# EasyEDA Pro project Car.eprj, schematic Schematic1
Board Name: EverythingElse; Create Date: 2025-08-09; Page Name: P1; Project Name: Car; Schematic Name: Schematic1; Update Date: 2025-08-16; Company: EasyEDA.com; Page Size: A4; Version: V1.0
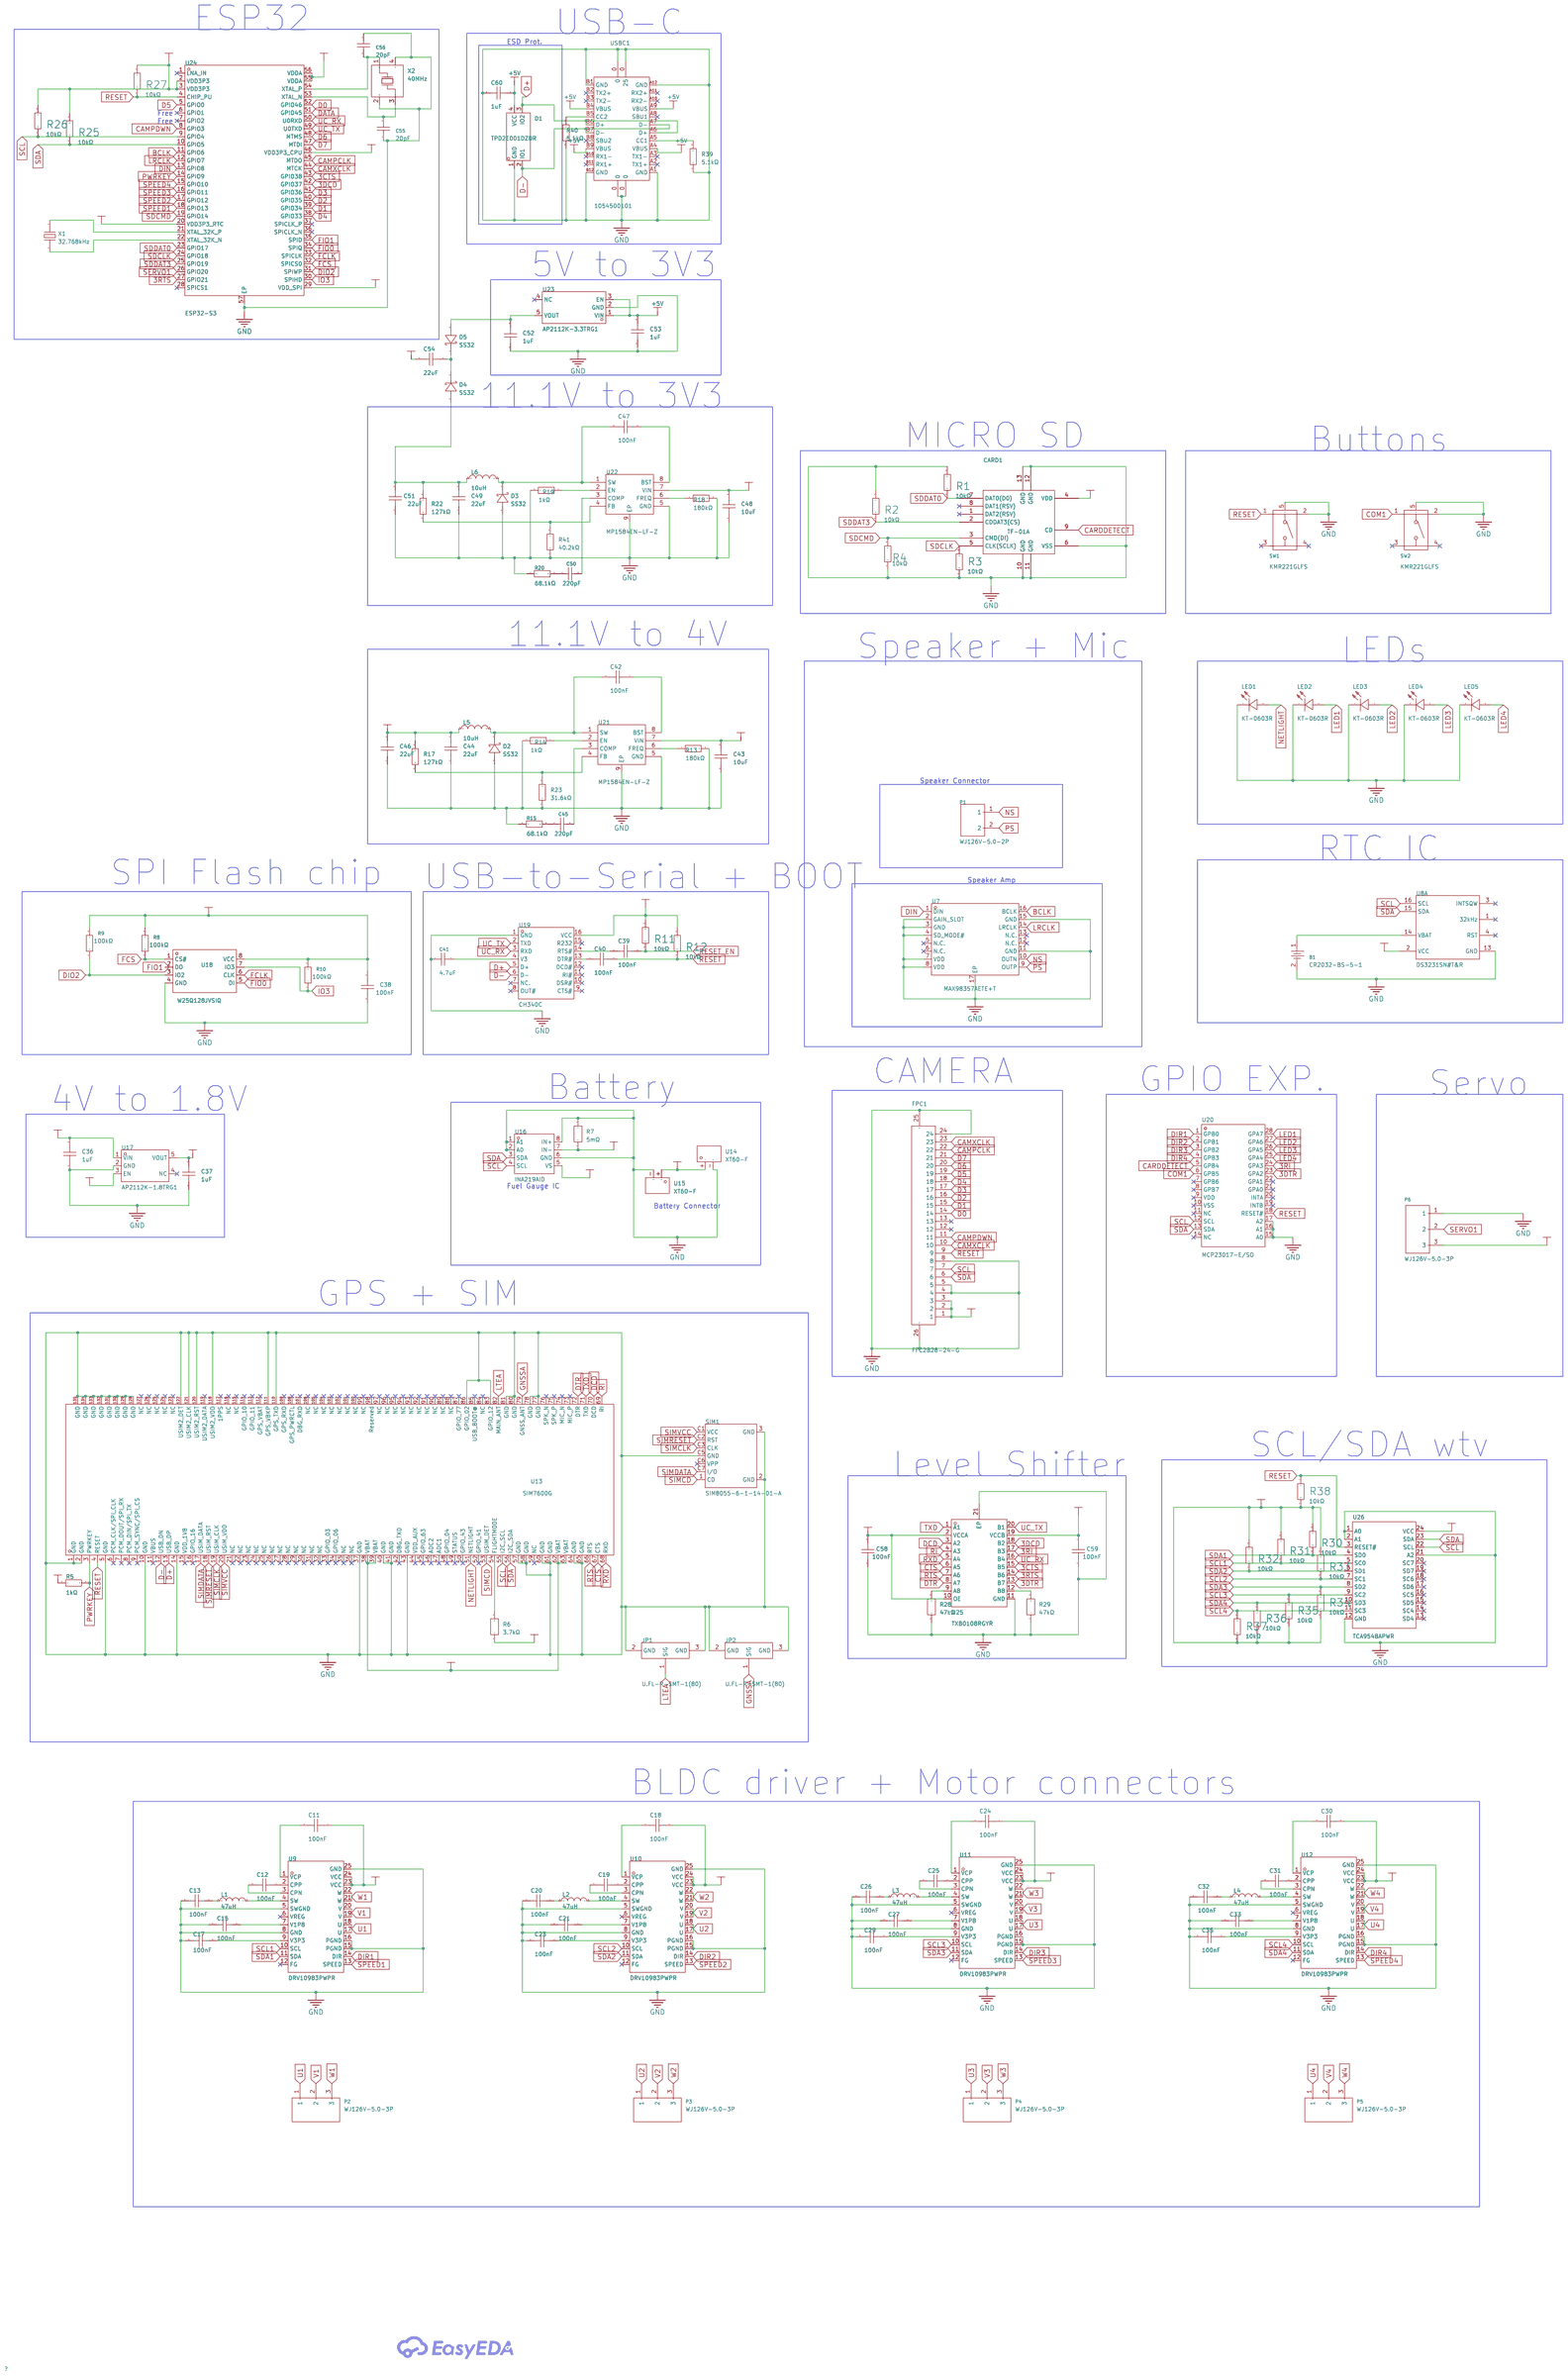
[diagram p0: schematic sheet]

## Parts
B1  CR2032-BS-5-1  [BAT-TH_CR2032-BS-5-1]
C11  100nF  [C0402]
C12  100nF  [C0402]
C13  100nF  [C0402]
C15  100nF  [C0402]
C17  100nF  [C0402]
C18  100nF  [C0402]
C19  100nF  [C0402]
C20  100nF  [C0402]
C21  100nF  [C0402]
C23  100nF  [C0402]
C24  100nF  [C0402]
C25  100nF  [C0402]
C26  100nF  [C0402]
C27  100nF  [C0402]
C29  100nF  [C0402]
C30  100nF  [C0402]
C31  100nF  [C0402]
C32  100nF  [C0402]
C33  100nF  [C0402]
C35  100nF  [C0402]
C36  1uF  [C0603]
C37  1uF  [C0603]
C38  100nF  [C0402]
C39  100nF  [C0402]
C40  100nF  [C0402]
C41  4.7uF  [C0402]
C42  100nF  [C0402]
C43  10uF  [C0805]
C44  22uF  [C0805]
C45  220pF  [C0603]
C46  22uF  [C0805]
C47  100nF  [C0402]
C48  10uF  [C0805]
C49  22uF  [C0805]
C50  220pF  [C0603]
C51  22uF  [C0805]
C52  1uF  [C0603]
C53  1uF  [C0603]
C54  22uF  [C0805]
C55  20pF  [C0402]
C56  20pF  [C0402]
C58  100nF  [C0402]
C59  100nF  [C0402]
C60  1uF  [C0603]
CARD1  TF-01A  [TF-SMD_TF-01A]
D1  TPD2E001DZDR  [SOT-143_L2.9-W1.3-P1.92-LS2.3-BR]
D2  SS32  [SMAF_L4.3-W2.5-LS5.0-RD]
D3  SS32  [SMAF_L4.3-W2.5-LS5.0-RD]
D4  SS32  [SMAF_L4.3-W2.5-LS5.0-RD]
D5  SS32  [SMAF_L4.3-W2.5-LS5.0-RD]
FPC1  FFC2B28-24-G  [FPC-SMD_24P-P0.50_XKB_X05A10L24G]
JP1  U.FL-R-SMT-1(80)  [RF-SMD_FRF05002-JSS103M]
JP2  U.FL-R-SMT-1(80)  [RF-SMD_FRF05002-JSS103M]
L1  47uH  [IND-SMD_L7.0-W6.6_FXL0630]
L2  47uH  [IND-SMD_L7.0-W6.6_FXL0630]
L3  47uH  [IND-SMD_L7.0-W6.6_FXL0630]
L4  47uH  [IND-SMD_L7.0-W6.6_FXL0630]
L5  10uH  [IND-SMD_L12.0-W12.0]
L6  10uH  [IND-SMD_L12.0-W12.0]
LED1  KT-0603R  [LED0603-RD]
LED2  KT-0603R  [LED0603-RD]
LED3  KT-0603R  [LED0603-RD]
LED4  KT-0603R  [LED0603-RD]
LED5  KT-0603R  [LED0603-RD]
P1  WJ126V-5.0-2P  [CONN-TH_WJ126V-5.0-2P]
P2  WJ126V-5.0-3P  [CONN-TH_3P-P5.00_WJ126V-5.0-3P]
P3  WJ126V-5.0-3P  [CONN-TH_3P-P5.00_WJ126V-5.0-3P]
P4  WJ126V-5.0-3P  [CONN-TH_3P-P5.00_WJ126V-5.0-3P]
P5  WJ126V-5.0-3P  [CONN-TH_3P-P5.00_WJ126V-5.0-3P]
P6  WJ126V-5.0-3P  [CONN-TH_3P-P5.00_WJ126V-5.0-3P]
R1  10kΩ  [R0603]
R2  10kΩ  [R0603]
R3  10kΩ  [R0603]
R4  10kΩ  [R0603]
R5  1kΩ  [R0603]
R6  3.7kΩ  [C0805]
R7  5mΩ  [R2818]
R8  100kΩ  [R0402]
R9  100kΩ  [R0402]
R10  100kΩ  [R0402]
R11  10kΩ  [R0603]
R12  10kΩ  [R0603]
R13  180kΩ  [R0603]
R14  1kΩ  [R0603]
R15  68.1kΩ  [R0603]
R17  127kΩ  [R0603]
R18  180kΩ  [R0603]
R19  1kΩ  [R0603]
R20  68.1kΩ  [R0603]
R22  127kΩ  [R0603]
R23  31.6kΩ  [R0402]
R25  10kΩ  [R0603]
R26  10kΩ  [R0603]
R27  10kΩ  [R0603]
R28  47kΩ  [R0603]
R29  47kΩ  [R0603]
R30  10kΩ  [R0603]
R31  10kΩ  [R0603]
R32  10kΩ  [R0603]
R33  10kΩ  [R0603]
R34  10kΩ  [R0603]
R35  10kΩ  [R0603]
R36  10kΩ  [R0603]
R37  10kΩ  [R0603]
R38  10kΩ  [R0603]
R39  5.1kΩ  [R0603]
R40  5.1kΩ  [R0603]
R41  40.2kΩ  [R0603]
SIM1  SIM8055-6-1-14-01-A  [SIM-SMD_SIM8055-6-1-14-01-A]
SW1  KMR221GLFS  [KEY-SMD_KMR2XXGXXX]
SW2  KMR221GLFS  [KEY-SMD_KMR2XXGXXX]
U7  MAX98357AETE+T  [TQFN-16_L3.0-W3.0-P0.50-BL-EP1.5]
U8  DS3231SN#T&R  [SOIC-16_L10.3-W7.5-P1.27-LS10.3-BL]  (section 1)
U9  DRV10983PWPR  [HTSSOP-24_L7.8-W4.4-P0.65-LS6.4-BL-EP-1]
U10  DRV10983PWPR  [HTSSOP-24_L7.8-W4.4-P0.65-LS6.4-BL-EP-1]
U11  DRV10983PWPR  [HTSSOP-24_L7.8-W4.4-P0.65-LS6.4-BL-EP-1]
U12  DRV10983PWPR  [HTSSOP-24_L7.8-W4.4-P0.65-LS6.4-BL-EP-1]
U13  SIM7600G  [COMM-SMD_135P-L30.0-W30.0_SIM7600G]
U14  XT60-F  [CONN-TH_XT60PB-F]
U15  XT60-F  [CONN-TH_XT60PB-F]
U16  INA219AID  [SOIC-8_L4.9-W3.9-P1.27-LS6.0-BL]
U17  AP2112K-1.8TRG1  [SOT-25_L3.0-W1.6-P0.95-LS2.8-BL]
U18  W25Q128JVSIQ  [SOIC-8_L5.3-W5.3-P1.27-LS8.0-BL]
U19  CH340C  [SOP-16_L10.0-W3.9-P1.27-LS6.0-BL]
U20  MCP23017-E/SO  [SOIC-28_L18.0-W7.5-P1.27-LS10.3-BL]
U21  MP1584EN-LF-Z  [SOIC-8_L5.0-W4.0-P1.27-LS6.0-BL-EP2.0]
U22  MP1584EN-LF-Z  [SOIC-8_L5.0-W4.0-P1.27-LS6.0-BL-EP2.0]
U23  AP2112K-3.3TRG1  [SOT-25-5_L2.9-W1.6-P0.95-LS2.8-BL]
U24  ESP32-S3  [QFN-56_L7.0-W7.0-P0.40-TL-EP4.0]
U25  TXB0108RGYR  [VQFN-20_L4.5-W3.5-P0.50-BL-EP]
U26  TCA9548APWR  [TSSOP-24_L7.8-W4.4-P0.65-LS6.4-BL]
USBC1  1054500101  [USB-C-SMD_TYPE-C-USB-18]
X1  32.768kHz  [OSC-SMD_L3.2-W1.5]
X2  40MHz  [OSC-SMD_4P-L3.2-W2.5-BL_SIT8008BI]

## Library data of the parts
B1 = CR2032-BS-5-1: Supplier Part: C70379; Manufacturer: Q&J; Supplier Footprint: 插件; JLCPCB Part Class: Extended Part; Datasheet: https://atta.szlcsc.com/upload/public/pdf/source/20160427/1461725216620.pdf; Supplier: LCSC
C11-C13 C15 C17-C21 C23-C27 C29-C33 C35 C38-C40 C42 C47 C58 C59 = CL05B104KO5NNNC: LCSC Part Name: 100nF ±10% 16V; Supplier Part: C1525; Manufacturer: SAMSUNG(三星); Supplier Footprint: 0402; JLCPCB Part Class: Basic Part; Datasheet: https://atta.szlcsc.com/upload/public/pdf/source/20160218/1457707763339.pdf; Supplier: LCSC; Tolerance: ±10%
C36 C37 C52 C53 C60 = CL10A105KB8NNNC: LCSC Part Name: 1uF ±10% 50V; Supplier Part: C15849; Manufacturer: SAMSUNG(三星); Supplier Footprint: 0603; JLCPCB Part Class: Basic Part; Datasheet: https://atta.szlcsc.com/upload/public/pdf/source/20160218/1457707763339.pdf; Supplier: LCSC; Tolerance: ±10%
C41 = CL05A475MP5NRNC: LCSC Part Name: 4.7uF ±20% 10V; Supplier Part: C23733; Manufacturer: SAMSUNG(三星); Supplier Footprint: 0402; JLCPCB Part Class: Basic Part; Datasheet: https://atta.szlcsc.com/upload/public/pdf/source/20160218/1457707763339.pdf; Supplier: LCSC; Tolerance: ±20%
C43 C48 = CL21A106KAYNNNE_C15850: LCSC Part Name: 10uF ±10% 25V; Supplier Part: C15850; Manufacturer: SAMSUNG(三星); Manufacturer Part: CL21A106KAYNNNE; Supplier Footprint: 0805; JLCPCB Part Class: Basic Part; Datasheet: https://atta.szlcsc.com/upload/public/pdf/source/20160218/1457707763339.pdf; Supplier: LCSC; Tolerance: ±10%
C44 C46 C49 C51 C54 = CL21A226MQQNNNE: LCSC Part Name: 22uF ±20% 6.3V; Supplier Part: C5674; Manufacturer: SAMSUNG(三星); Supplier Footprint: 0805; JLCPCB Part Class: Extended Part; Datasheet: https://atta.szlcsc.com/upload/public/pdf/source/20160218/1457707763339.pdf; Supplier: LCSC; Tolerance: ±20%
C45 C50 = CC0603KRX7R9BB221: LCSC Part Name: 220pF ±10% 50V; Supplier Part: C107081; Manufacturer: YAGEO(国巨); Supplier Footprint: 0603; JLCPCB Part Class: Extended Part; Datasheet: https://atta.szlcsc.com/upload/public/pdf/source/20180910/C282072_33301C7F631E79921B82A8DAC6BCC5B3.pdf; Supplier: LCSC; Tolerance: ±10%
C55 C56 = CC0402JRNPO9BN200: LCSC Part Name: 20pF ±5% 50V; Supplier Part: C107000; Manufacturer: YAGEO(国巨); Supplier Footprint: 0402; JLCPCB Part Class: Extended Part; Datasheet: https://atta.szlcsc.com/upload/public/pdf/source/20170914/C128857_1505359892143968080.pdf; Supplier: LCSC; Tolerance: ±5%
CARD1 = TF-01A_C91145: LCSC Part Name: 自弹式 MicroSD卡(TF卡) 卡座; Supplier Part: C91145; Manufacturer: 韩国韩荣; Supplier Footprint: SMD; JLCPCB Part Class: Extended Part; Datasheet: https://atta.szlcsc.com/upload/public/pdf/source/20190322/C91145_63CBD6FB4639A3A3EC6A9721F18AE0FB.pdf; Supplier: LCSC; Card Connection Mode: Self-bouncing; Card Type: MicroSD card (TF card); Connector Type: Card Slot; Supplementary Features: With Locating Pin; Maximum Body Height: 1.85mm
D1 = TPD2E001DZDR: Supplier Part: C89411; Manufacturer: TI(德州仪器); Supplier Footprint: SOT-23-4; JLCPCB Part Class: Extended Part; Datasheet: https://www.ti.com/cn/lit/gpn/tpd2e001; Supplier: LCSC; Polarity: Unidirectional; Reverse Stand-Off Voltage (Vrwm): 5.5V; Voltage - Breakdown: 11V; Reverse Leakage Current (Ir): 1nA; Number of Channels: 2; Operating Temperature: -40℃~+85℃; level of protection: IEC 61000-4-2; Type: ESD; Junction Capacitance: 1.5pF
D2-D5 = SS32_C727059: LCSC Part Name: 电压:20V 电流:3A; Supplier Part: C727059; Manufacturer: TWGMC(台湾迪嘉); Supplier Footprint: SMA(DO-214AC); JLCPCB Part Class: Extended Part; Datasheet: https://atta.szlcsc.com/upload/public/pdf/source/20200828/C727059_6599B6CAC5F3238B9C33E46794659DBE.pdf; Supplier: LCSC; Diode Configuration: Independent Type; Forward Voltage (Vf@If): 550mV@3A; Reverse Voltage (Vr): 20V; Rectified Current: 3A; Reverse Leakage Current (Ir): 500uA
FPC1 = FFC2B28-24-G: LCSC Part Name: 间距:0.5mm P数:24P 翻盖式 双侧触点/上下接; Supplier Part: C3151659; Manufacturer: GCT; Supplier Footprint: SMD,P=0.5mm,卧贴; JLCPCB Part Class: Extended Part; Datasheet: https://atta.szlcsc.com/upload/public/pdf/source/20220622/7ED6AF1A7288FCDAA24419D455433CA8.pdf; Supplier: LCSC; Locking Feature: Flip type; Contact Type: Dual-sided contacts / top and bottom connection; Number of Contacts: 24P; Pitch: 0.5mm; Mounting Type: Horizontal attachment; FFC, FCB Thickness: 0.3mm; Height Above Board: 1mm; Contact Material: Copper alloy; Contact Plating: Gold; Operating Temperature Range: -25℃~+85℃
JP1 JP2 = U.FL-R-SMT-1(80)_C88374: LCSC Part Name: IPEX 内针; Supplier Part: C88374; Manufacturer: HRS(广濑); Supplier Footprint: SMD; JLCPCB Part Class: Extended Part; Datasheet: https://atta.szlcsc.com/upload/public/pdf/source/20161125/1480067868647.pdf; Supplier: LCSC; Connector Type: 板端; Interface Type: 内针; Number of Ports: 1; Interface Diameter: 2mm; Interface Length/Height: 1.25mm; Frequency-Max: 6GHz; RF Series: IPEX; Impedance: 50Ω; Contact Material: Brass; Operating Temperature Range: -40℃~+90℃
L1-L4 = FXL0630-470-M: LCSC Part Name: 47uH ±20% 2A; Supplier Part: C475913; Manufacturer: cjiang(长江微电); Supplier Footprint: SMD,6.6x7mm; JLCPCB Part Class: Extended Part; Datasheet: https://atta.szlcsc.com/upload/public/pdf/source/20240426/3189EA8206330E2108542F9E34E540E7.pdf; Supplier: LCSC; Tolerance: ±20%; Saturation Current (Isat): 2A; Type: Integrated molded inductor
L5 L6 = YPRH1204-100M: LCSC Part Name: 10uH ±20%; Supplier Part: C504018; Manufacturer: YJYCOIN(益嘉源); Supplier Footprint: SMD,12x12mm; JLCPCB Part Class: Extended Part; Datasheet: https://atta.szlcsc.com/upload/public/pdf/source/20200417/C504018_57B2712EA25C12C35A66BB4D1AF01B38.pdf; Supplier: LCSC; Tolerance: ±20%
LED1-LED5 = KT-0603R: LCSC Part Name: 0603 红灯 高亮; Supplier Part: C2286; Manufacturer: KENTO; Supplier Footprint: 0603; JLCPCB Part Class: Basic Part; Datasheet: https://atta.szlcsc.com/upload/public/pdf/source/20160616/1466072038404.pdf; Supplier: LCSC; Emitted Color: Red; Operating Temperature: -40℃~+85℃
P1 = WJ126V-5.0-2P: LCSC Part Name: 5mm 1x2P 排数:1 每排P数:2 直插; Supplier Part: C8404; Manufacturer: KANGNEX(康奈克斯电气); Supplier Footprint: 插件,P=5mm; JLCPCB Part Class: Extended Part; Datasheet: https://atta.szlcsc.com/upload/public/pdf/source/20191225/C8404_8F52D87DF851D149A4DEA9BD9FA83F9A.pdf; Supplier: LCSC; Structure: 1x2P; Pitch: 5mm; Color: Green; Mounting Style: Straight; Current Rating (Max): 18A; Voltage Rating (Max): 250V; Number of Pins: 2P; Number of Rows: 1; Wire Gauge - AWG: 14~26; Wire Gauge - mm2: 2.5; Number of PINs Per Row: 2; Operating Temperature Range: -40℃~+105℃
P2-P6 = WJ126V-5.0-3P: LCSC Part Name: 5mm 1x3P 排数:1 每排P数:3 直插; Supplier Part: C8401; Manufacturer: KANGNEX(康奈克斯电气); Supplier Footprint: 插件,P=5mm; JLCPCB Part Class: Extended Part; Datasheet: https://atta.szlcsc.com/upload/public/pdf/source/20191225/C8401_BC4AEF85CCBF7CDF5CCE64583ADD1E63.pdf; Supplier: LCSC; Structure: 1x3P; Pitch: 5mm; Color: Green; Mounting Style: Straight; Current Rating (Max): 18A; Voltage Rating (Max): 250V; Number of Pins: 3P; Number of Rows: 1; Wire Gauge - AWG: 14~26; Wire Gauge - mm2: 2.5; Number of PINs Per Row: 3; Operating Temperature Range: -40℃~+105℃
R1-R4 R11 R12 R25-R27 R30-R38 = 0603WAF1002T5E: LCSC Part Name: 厚膜电阻 10kΩ ±1% 100mW; Supplier Part: C25804; Manufacturer: UNI-ROYAL(厚声); Supplier Footprint: 0603; JLCPCB Part Class: Basic Part; Datasheet: https://atta.szlcsc.com/upload/public/pdf/source/20200306/C422600_1E6D84923E4A46A82E41ADD87F860B5C.pdf; Supplier: LCSC; Type: Thick Film Resistor; Tolerance: ±1%; Power(Watts): 100mW; Voltage-Supply(Max): 75V; Temperature Coefficient: ±100ppm/℃; Operating Temperature: -55℃~+155℃
R5 R14 R19 = 0603WAF1001T5E: LCSC Part Name: 1kΩ ±1% 100mW 厚膜电阻; Supplier Part: C21190; Manufacturer: UNI-ROYAL(厚声); Supplier Footprint: 0603; JLCPCB Part Class: Basic Part; Datasheet: https://atta.szlcsc.com/upload/public/pdf/source/20200306/C422600_1E6D84923E4A46A82E41ADD87F860B5C.pdf; Supplier: LCSC; Type: Thick Film Resistors; Tolerance: ±1%; Temperature Coefficient: ±100ppm/℃; Operating Temperature Range: -55℃~+155℃
R6 = FRC0805F3701TS: LCSC Part Name: 3.7kΩ ±1% 125mW 厚膜电阻; Supplier Part: C3013219; Manufacturer: FOJAN(富捷); Supplier Footprint: 0805; JLCPCB Part Class: Extended Part; Datasheet: https://atta.szlcsc.com/upload/public/pdf/source/20211221/925EC7D7225764EE0046F22065062C87.pdf; Supplier: LCSC; Type: Thick Film Resistors; Tolerance: ±1%; Temperature Coefficient: ±100ppm/℃
R7 = WSHP28185L000FEA: LCSC Part Name: 5mΩ ±1% 10W; Supplier Part: C2090564; Manufacturer: VISHAY(威世); Supplier Footprint: 2818; JLCPCB Part Class: Extended Part; Datasheet: https://atta.szlcsc.com/upload/public/pdf/source/20210505/603DE6E459833D7009A490D9BE21F641.pdf; Supplier: LCSC; Type: Current Sensing Resistors; Tolerance: ±1%; Power(Watts): 10W; Temperature Coefficient: ±200ppm/℃; Mounting Type: Patch
R8-R10 = 0402WGF1003TCE: LCSC Part Name: 100kΩ ±1% 62.5mW 厚膜电阻; Supplier Part: C25741; Manufacturer: UNI-ROYAL(厚声); Supplier Footprint: 0402; JLCPCB Part Class: Basic Part; Datasheet: https://atta.szlcsc.com/upload/public/pdf/source/20200306/C422600_1E6D84923E4A46A82E41ADD87F860B5C.pdf; Supplier: LCSC; Type: Thick Film Resistors; Tolerance: ±1%; Temperature Coefficient: ±100ppm/℃; Operating Temperature Range: -55℃~+155℃
R13 R18 = 0603WAF1803T5E: LCSC Part Name: 180kΩ ±1% 100mW 厚膜电阻; Supplier Part: C22827; Manufacturer: UNI-ROYAL(厚声); Supplier Footprint: 0603; JLCPCB Part Class: Extended Part; Datasheet: https://atta.szlcsc.com/upload/public/pdf/source/20200306/C422600_1E6D84923E4A46A82E41ADD87F860B5C.pdf; Supplier: LCSC; Type: Thick Film Resistors; Tolerance: ±1%; Temperature Coefficient: ±100ppm/℃; Operating Temperature Range: -55℃~+155℃
R15 R20 = 0603WAF6812T5E: LCSC Part Name: 68.1kΩ ±1% 100mW 厚膜电阻; Supplier Part: C25976; Manufacturer: UNI-ROYAL(厚声); Supplier Footprint: 0603; JLCPCB Part Class: Extended Part; Datasheet: https://atta.szlcsc.com/upload/public/pdf/source/20200306/C422600_1E6D84923E4A46A82E41ADD87F860B5C.pdf; Supplier: LCSC; Type: Thick Film Resistors; Tolerance: ±1%; Temperature Coefficient: ±100ppm/℃; Operating Temperature Range: -55℃~+155℃
R17 R22 = RC0603FR-07127KL: LCSC Part Name: 厚膜电阻 127kΩ ±1% 100mW; Supplier Part: C245905; Manufacturer: YAGEO(国巨); Supplier Footprint: 0603; JLCPCB Part Class: Extended Part; Datasheet: https://atta.szlcsc.com/upload/public/pdf/source/20250610/89E4D743C004A82A45145C7A2CC3A578.pdf; Supplier: LCSC; Type: Thick Film Resistor; Tolerance: ±1%; Power(Watts): 100mW; Voltage-Supply(Max): 75V; Temperature Coefficient: ±100ppm/℃; Operating Temperature: -55℃~+155℃
R23 = 0402WGF3162TCE: LCSC Part Name: 31.6kΩ ±1% 62.5mW 厚膜电阻; Supplier Part: C11463; Manufacturer: UNI-ROYAL(厚声); Supplier Footprint: 0402; JLCPCB Part Class: Extended Part; Datasheet: https://atta.szlcsc.com/upload/public/pdf/source/20200306/C422600_1E6D84923E4A46A82E41ADD87F860B5C.pdf; Supplier: LCSC; Type: Thick Film Resistors; Tolerance: ±1%; Temperature Coefficient: ±100ppm/℃; Operating Temperature Range: -55℃~+155℃
R28 R29 = FRC0603F4702TS: LCSC Part Name: 47kΩ ±1% 100mW 厚膜电阻; Supplier Part: C2907042; Manufacturer: FOJAN(富捷); Supplier Footprint: 0603; JLCPCB Part Class: Extended Part; Datasheet: https://atta.szlcsc.com/upload/public/pdf/source/20211221/925EC7D7225764EE0046F22065062C87.pdf; Supplier: LCSC; Type: Thick Film Resistors; Tolerance: ±1%; Temperature Coefficient: ±100ppm/℃; Operating Temperature Range: -55℃~+155℃
R39 R40 = 0603WAF5101T5E: LCSC Part Name: 5.1kΩ ±1% 100mW 厚膜电阻; Supplier Part: C23186; Manufacturer: UNI-ROYAL(厚声); Supplier Footprint: 0603; JLCPCB Part Class: Basic Part; Datasheet: https://item.szlcsc.com/datasheet/0603WAF5101T5E/23913.html; Supplier: LCSC; Type: Thick Film Resistor; Tolerance: ±1%; Power(Watts): 100mW; Voltage-Supply(Max): 75V; Temperature Coefficient: ±100ppm/℃; Operating Temperature: -55℃~+155℃
R41 = 0603WAF4022T5E: LCSC Part Name: 40.2kΩ ±1% 100mW 厚膜电阻; Supplier Part: C12447; Manufacturer: UNI-ROYAL(厚声); Supplier Footprint: 0603; JLCPCB Part Class: Extended Part; Datasheet: https://atta.szlcsc.com/upload/public/pdf/source/20200306/C422600_1E6D84923E4A46A82E41ADD87F860B5C.pdf; Supplier: LCSC; Type: Thick Film Resistors; Tolerance: ±1%; Temperature Coefficient: ±100ppm/℃; Operating Temperature Range: -55℃~+155℃
SIM1 = SIM8055-6-1-14-01-A: LCSC Part Name: 拔插式 NanoSIM卡; Supplier Part: C7363815; Manufacturer: GCT; JLCPCB Part Class: Extended Part; Datasheet: https://atta.szlcsc.com/upload/public/pdf/source/231023/sim8055.pdf-7225d3638e74d7c4417af3535dccc835.pdf; Supplier: LCSC; Card Connection Mode: Plug-in; Card Type: Nano SIM card; Body Height (Max): 1.35mm
SW1 SW2 = KMR221GLFS: LCSC Part Name: 4.6*2.8*1.9mm 立贴 轻触开关; Supplier Part: C72443; Manufacturer: C&K; Supplier Footprint: SMD; JLCPCB Part Class: Extended Part; Datasheet: https://atta.szlcsc.com/upload/public/pdf/source/20181012/C265019_000848423B8E84768868498C37CC451B.pdf; Supplier: LCSC; Circuit: SPST; Actuator Style: Round Button; Operating Force: 200gf; Mounting Style: Brick nogging; Switch Length: 4.6mm; Switch Width: 2.8mm; Switch Height: 1.9mm; Contact Current: 50mA; Voltage Rating (DC): 32V; Pin Style: Gull Wing; Operating Temperature: -40℃~+85℃
U7 = MAX98357AETE+T: LCSC Part Name: 微型、低成本、PCM 类 D 级放大器具有 AB 级性能; Supplier Part: C910544; Manufacturer: ADI(亚德诺)/MAXIM(美信); Supplier Footprint: TQFN-16-EP(3x3); JLCPCB Part Class: Extended Part; Datasheet: https://atta.szlcsc.com/upload/public/pdf/source/20210106/C910544_CB6DE4B2CEE254A72E6BDB40E718D281.pdf; Supplier: LCSC; Voltage - Supply: 2.5V~5.5V; Operating Temperature: -40℃~+85℃
U8 = DS3231SN#T&R: LCSC Part Name: 超高精度、I²C接口、集成RTC/TCXO/晶体; Supplier Part: C9866; Manufacturer: ADI(亚德诺)/MAXIM(美信); Supplier Footprint: SOIC-16-300mil; JLCPCB Part Class: Extended Part; Datasheet: https://item.szlcsc.com/datasheet/DS3231SN%2523T%2526R/10398.html; Supplier: LCSC; Interface: I2C; Voltage - Supply: 2.3V~5.5V; Operating Temperature: -40℃~+85℃
U9-U12 = DRV10983PWPR: LCSC Part Name: 2A 无刷直流BLDC电机驱动芯片 28V; Supplier Part: C115806; Manufacturer: TI(德州仪器); Supplier Footprint: HTSSOP-24-EP; JLCPCB Part Class: Extended Part; Datasheet: https://www.ti.com/cn/lit/gpn/drv10983; Supplier: LCSC; Output Current: 2A; RDS(on): 250mΩ; Interface: I2C; Operating Temperature: -40℃~+125℃
U13 = SIM7600G: Supplier Part: C5354753; Manufacturer: SIMCOM(芯讯通无线科技); Supplier Footprint: SMD,30x30mm; JLCPCB Part Class: Extended Part; Datasheet: https://atta.szlcsc.com/upload/public/pdf/source/20231229/240E3B9F5EAC246FE328D39ABFB18210.pdf; Supplier: LCSC
U14 U15 = XT60-F: LCSC Part Name: AMASS(艾迈斯)XT60模型插头 3.5mm镀金香蕉头母头 XT60-F; Supplier Part: C98734; Manufacturer: AMASS(艾迈斯); JLCPCB Part Class: Extended Part; Datasheet: https://item.szlcsc.com/datasheet/XT60-F/99944.html; Supplier: LCSC; Type: Banana plug; Colour: Yellow; InterfaceType: Female; MetalMaterial: Gold plating
U16 = INA219AID: LCSC Part Name: 具有I2C接口的零漂移双向电流/功率监测计; Supplier Part: C1574856; Manufacturer: TI(德州仪器); Supplier Footprint: SOIC-8; JLCPCB Part Class: Extended Part; Datasheet: https://www.ti.com/cn/lit/gpn/ina219; Supplier: LCSC; Number of Channels: 1; Vcm - Common Mode Voltage: 300mV~26V; Operating Temperature: -40℃~+125℃
U17 = AP2112K-1.8TRG1: LCSC Part Name: 600mA CMOS低压差线性稳压器; Supplier Part: C176944; Manufacturer: DIODES(美台); Supplier Footprint: SOT-25; JLCPCB Part Class: Extended Part; Datasheet: https://atta.szlcsc.com/upload/public/pdf/source/20171221/C51118_15138312998391195590.pdf; Supplier: LCSC; Output Type: Fixed; Voltage - Supply: 6V; Output Voltage: 1.8V; Output Current: 600mA; Power Supply Rejection Ratio (PSRR): 65dB@(1kHz); Voltage Dropout: 500mV@(600mA); standby current: 55uA; Noise: 50uVrms; Features: Over Current Protection；Enable；Over Temperature Protection; Operating Temperature: -40℃~+85℃@(Ta); Output Configuration: Positive; Number of Outputs: 1
U18 = W25Q128JVSIQ: LCSC Part Name: W25Q128JVSIQ 编带; Supplier Part: C97521; Manufacturer: WINBOND(华邦); Supplier Footprint: SOIC-8-208mil; JLCPCB Part Class: Basic Part; Datasheet: https://atta.szlcsc.com/upload/public/pdf/source/20170316/1489627409956.pdf; Supplier: LCSC; Interface Type: SPI; Memory Size: 128Mbit; Clock Frequency (fc): 133MHz; Supply Voltage: 2.7V~3.6V; Page Programming Time (Tpp): 700us; Block Erase Time (tBE): 120ms@(32KB); Data Retention - TDR (Year): 20 years; Operating Temperature: -40℃~+85℃
U19 = CH340C: Supplier Part: C84681; Manufacturer: WCH(南京沁恒); Supplier Footprint: SOP-16; JLCPCB Part Class: Extended Part; Datasheet: https://atta.szlcsc.com/upload/public/pdf/source/20250604/33626338A5406B1E2A8163A86C0531AF.pdf; Supplier: LCSC; Applications Function: Transceiver; USB Protocol: USB 2.0; Voltage - Supply: 3.3V；5V; Data Rate: 2Mbps
U20 = MCP23017-E/SO: LCSC Part Name: 16位I/O扩展器带串行接口; Supplier Part: C47023; Manufacturer: MICROCHIP(美国微芯); Supplier Footprint: SOIC-28-300mil; JLCPCB Part Class: Extended Part; Datasheet: https://atta.szlcsc.com/upload/public/pdf/source/20221209/1BF939F88C2D907BC056D7BF485E3103.pdf; Supplier: LCSC; Number of I/O: 16; Interrupt Output: With Interrupt Output; Voltage - Supply: 1.8V~5.5V; Clock Frequency: 1.7MHz; Operating Temperature: -40℃~+85℃
U21 U22 = MP1584EN-LF-Z: LCSC Part Name: 3A、1.5MHz、28V降压转换器; Supplier Part: C15051; Manufacturer: MPS(芯源); Supplier Footprint: SOIC-8-EP; JLCPCB Part Class: Extended Part; Datasheet: https://item.szlcsc.com/datasheet/MP1584EN-LF-Z/15724.html; Supplier: LCSC; Function: Buck; Output Type: Adjustable; Voltage - Supply: 4.5V~28V; Output Current: 3A; Frequency - Switching: 100kHz~1.5MHz; Operating Temperature: -20℃~+85℃@(TA); Synchronous Rectifier: No; Number of Outputs: 1; Topology: Buck; Quiescent Current: 100uA; Switch tube (built-in/external): Built-in
U23 = AP2112K-3.3TRG1: LCSC Part Name: 输入6V 输出3.3V 600mA; Supplier Part: C51118; Manufacturer: DIODES(美台); Supplier Footprint: SOT-25-5; JLCPCB Part Class: Extended Part; Datasheet: https://item.szlcsc.com/datasheet/AP2112K-3.3TRG1/52131.html; Supplier: LCSC; Output Type: Fixed; Voltage - Supply: 6V; Output Voltage: 3.3V; Output Current: 600mA; Power Supply Rejection Ratio (PSRR): 65dB@(1kHz); Voltage Dropout: 250mV@(600mA); standby current: 55uA; Noise: 50uVrms; Features: Enable；Over Temperature Protection；Over Current Protection; Operating Temperature: -40℃~+85℃@(Ta); Output Configuration: Positive; Number of Outputs: 1
U24 = ESP32-S3: LCSC Part Name: 支持2.4GHz WIFI和低功耗蓝牙的MCU SoC; Supplier Part: C2913192; Manufacturer: ESPRESSIF(乐鑫); Supplier Footprint: QFN-56-EP(7x7); JLCPCB Part Class: Extended Part; Datasheet: https://atta.szlcsc.com/upload/public/pdf/source/20241030/3428D9BCA56E860957850BFAF37EAC62.pdf; Supplier: LCSC; Frequency Range: 2.412GHz~2.484GHz; Interface: ADC；SPI；PWM；I2C；I2S；USB；UART; Voltage - Supply: 3V~3.6V; Applications: WiFi；IoT; Output Power: 21dBm; Data Rate: 150Mbps; Current Of Transmitting: 340mA; Sensitivity: -98.4dBm; Receive Current: 88mA; Typical Application Frequency: 2.4GHz; Operating Temperature: -40℃~+105℃
U25 = TXB0108RGYR: LCSC Part Name: 100Mbps 8位双向电平转换器; Supplier Part: C194701; Manufacturer: TI(德州仪器); Supplier Footprint: VQFN-20-EP(3.5x4.5); JLCPCB Part Class: Extended Part; Datasheet: https://item.szlcsc.com/datasheet/TXB0108RGYR/238015.html; Supplier: LCSC; Channel Type: Bidirectional; Data Rate: 100Mbps; Voltage - Supply(VCCA): 1.2V~3.6V; Voltage - Supply(VCCB): 1.65V~5.5V; Number of Circuits: 8; Output Type: Tri-State; Operating Temperature: -40℃~+85℃; Features: Automatic Direction Detection
U26 = TCA9548APWR: LCSC Part Name: 支持复位的低压8通道I²C开关; Supplier Part: C130026; Manufacturer: TI(德州仪器); Supplier Footprint: TSSOP-24; JLCPCB Part Class: Extended Part; Datasheet: https://www.ti.com/cn/lit/gpn/tca9548a; Supplier: LCSC
USBC1 = 1054500101: LCSC Part Name: Type-C 母; Supplier Part: C134092; Manufacturer: MOLEX; Supplier Footprint: SMD; JLCPCB Part Class: Extended Part; Datasheet: https://www.molex.com/content/dam/molex/molex-dot-com/products/automated/en-us/salesdrawingpdf/105/105450/1054500101_sd.pdf?inline\; Supplier: LCSC; Connector Type: Type-C; Protocol Standard: USB 3.2; Gender: Female; Number of Contacts: 24P; Number of Ports: 1; Operating Temperature: -30℃~+85℃
X1 = X321532768KGD2SI: LCSC Part Name: YST310S 32.768KHZ 2P 3215 12.5PF ±20PPM -40~85℃; Supplier Part: C620155; Manufacturer: YXC(扬兴晶振); Supplier Footprint: SMD3215-2P; JLCPCB Part Class: Extended Part; Datasheet: https://atta.szlcsc.com/upload/public/pdf/source/20240329/3A7650FD985DD0DE85694D3785AB4916.pdf; Supplier: LCSC; Type: Surface Mount Crystal; Normal temperature Frequency Tolerance: ±20ppm; Load Capacitance: 12.5pF; Frequency Stability: ±30ppm; Operating Temperature: -40℃~+85℃
X2 = X322540MPB4SI: LCSC Part Name: YSX321SL 40MHZ 4P 3225 15PF ±10PPM -40~85℃ (±20PPM); Supplier Part: C9010; Manufacturer: YXC(扬兴晶振); Supplier Footprint: SMD3225-4P; JLCPCB Part Class: Extended Part; Datasheet: https://item.szlcsc.com/datasheet/X322540MPB4SI/9530.html; Supplier: LCSC; Type: Crystal Oscillator; Normal temperature Frequency Tolerance: ±10ppm; Load Capacitance: 15pF; Frequency Stability: ±20ppm; Operating Temperature: -40℃~+85℃

## Nets
+1.8V: C37.2 C58.1 R5.1 R6.1 U17.5(VOUT) U25.2(VCCA) U25.10(OE)
+3V3: C38.1 C54.2 C59.1 CARD1.4(VDD) FPC1.1 FPC1.2 FPC1.3 R8.2 R9.2 R10.2 R11.1 R12.1 R25.2 R26.2 R27.2 R30.2 R31.2 R32.2 R33.2 R34.2 R35.2 R36.2 R37.2 R38.2 U8.2(VCC) U16.5(VS) U18.8(VCC) U19.16(VCC) U24.2(VDD3P3) U24.3(VDD3P3) U24.20(VDD3P3_RTC) U24.29(VDD_SPI) U24.46(VDD3P3_CPU) U24.55(VDDA) U24.56(VDDA) U25.19(VCCB) U26.24(VCC)
+4V: C36.2 C44.2 C46.2 L5.1 P6.3 R17.2 U13.38(VBAT) U13.39(VBAT) U13.62(VBAT) U13.63(VBAT) U17.1(VIN) U17.3(EN)
+5V: C53.2 C60.1 D1.4(VCC) U23.1(VIN) U23.3(EN) USBC1.A4(VBUS) USBC1.A9(VBUS) USBC1.B4(VBUS) USBC1.B9(VBUS)
+11.1V: C11.1 C18.1 C24.1 C30.1 C43.2 C48.2 R7.1 U9.23(VCC) U9.24(VCC) U10.23(VCC) U10.24(VCC) U11.23(VCC) U11.24(VCC) U12.23(VCC) U12.24(VCC) U14.+(1) U15.+(1) U16.7(IN-) U21.7(VIN) U22.7(VIN)
GND: B1.2 C13.2 C15.2 C17.2 C20.2 C21.2 C23.2 C26.2 C27.2 C29.2 C32.2 C33.2 C35.2 C36.1 C37.1 C38.2 C41.1 C43.1 C44.1 C46.1 C48.1 C49.1 C51.1 C52.1 C53.1 C55.1 C56.2 C58.2 C59.2 C60.2 CARD1.6(VSS) CARD1.10(GND) CARD1.11(GND) CARD1.12(GND) CARD1.13(GND) D1.1(GND) D2.2(A) D3.2(A) FPC1.4 FPC1.5 FPC1.8 FPC1.24 FPC1.25 FPC1.26 JP1.2(GND) JP1.3(GND) JP2.2(GND) JP2.3(GND) LED1.1(K) LED2.1(K) LED3.1(K) LED4.1(K) LED5.1(K) P6.1 R1.2 R2.1 R3.1 R4.1 R7.2 R13.2 R14.2 R15.1 R18.2 R19.2 R20.1 R23.1 R28.1 R29.1 R39.1 R40.1 R41.1 SIM1.2(GND) SIM1.3(GND) SIM1.C5(GND) SW1.2 SW1.5 SW2.2 SW2.5 U7.2(GAIN_SLOT) U7.3(GND) U7.4(SD_MODE#) U7.7(VDD) U7.8(VDD) U7.11(GND) U7.15(GND) U7.17(EP) U8.13(GND) U9.5(SWGND) U9.8(GND) U9.15(PGND) U9.16(PGND) U9.25(GND) U10.5(SWGND) U10.8(GND) U10.15(PGND) U10.16(PGND) U10.25(GND) U11.5(SWGND) U11.8(GND) U11.15(PGND) U11.16(PGND) U11.25(GND) U12.5(SWGND) U12.8(GND) U12.15(PGND) U12.16(PGND) U12.25(GND) U13.1(GND) U13.2(GND) U13.5(GND) U13.10(GND) U13.14(GND) U13.37(GND) U13.40(GND) U13.41(GND) U13.43(GND) U13.57(GND) U13.58(GND) U13.60(GND) U13.61(GND) U13.64(GND) U13.65(GND) U13.77(GND) U13.78(GND) U13.80(GND) U13.81(GND) U13.83(GPIO_12) U13.86(GPIO_02) U13.110(GPS_TXD) U13.111(GPS_VBKP) U13.118(USIM2_VDD) U13.120(USIM2_RST) U13.121(USIM2_CLK) U13.122(USIM2_DET) U13.128(GND) U13.129(GND) U13.130(GND) U13.131(GND) U13.132(GND) U13.133(GND) U13.134(GND) U13.135(GND) U14.-(2) U15.-(2) U16.1(A1) U16.2(A0) U16.6(GND) U16.8(IN+) U17.2(GND) U18.4(GND) U19.1(GND) U20.15(A0) U20.16(A1) U20.17(A2) U21.5(GND) U21.9(EP) U22.5(GND) U22.9(EP) U23.2(GND) U24.57(EP) U25.11(GND) U25.21(EP) U26.1(A0) U26.2(A1) U26.12(GND) U26.21(A2) USBC1.0 USBC1.A1(GND) USBC1.A12(GND) USBC1.B1(GND) USBC1.B12(GND) X2.2(GND) X2.4(GND)
V1: P2.2 U9.19(V) U9.20(V)
V2: P3.2 U10.19(V) U10.20(V)
V3: P4.2 U11.19(V) U11.20(V)
V4: P5.2 U12.19(V) U12.20(V)
3CTS: U24.43(GPIO38) U25.15(B5)
3DCD: U24.42(GPIO37) U25.18(B2)
3DTR: U20.23(GPA2) U25.13(B7)
3RI: U20.24(GPA3) U25.17(B3)
3RTS: U24.27(GPIO21) U25.14(B6)
BCLK: U7.16(BCLK) U24.11(GPIO6)
CAMPCLK: FPC1.22 U24.45(MTDO)
CAMPDWN: FPC1.11 U24.8(GPIO3)
CAMXCLK: FPC1.10 FPC1.23 U24.44(MTCK)
CARDDETECT: CARD1.9(CD) U20.5(GPB4)
COM1: SW2.1 U20.6(GPB5)
CTS: U13.67(CTS) U25.6(A5)
D0: FPC1.14 U24.52(GPIO46)
D1: FPC1.15 U24.39(GPIO34)
D2: FPC1.16 U24.40(GPIO35)
D3: FPC1.17 U24.41(GPIO36)
D4: FPC1.18 U24.38(GPIO33)
D5: FPC1.19 U24.5(GPIO0)
D6: FPC1.20 U24.48(MTMS)
D7: FPC1.21 U24.47(MTDI)
D+: D1.3(IO2) U13.13(USB_DP) U19.5(D+) USBC1.A6(D+) USBC1.B6(D+)
D-: D1.2(IO1) U13.12(USB_DN) U19.6(D-) USBC1.A7(D-) USBC1.B7(D-)
DATA: U24.51(GPIO45)
DCD: U13.70(DCD) U25.3(A2)
DIN: U7.1(DIN) U24.13(GPIO8)
DIO2: R9.1 U18.3(IO2) U24.31(SPIWP)
DIR1: U9.14(DIR) U20.1(GPB0)
DIR2: U10.14(DIR) U20.2(GPB1)
DIR3: U11.14(DIR) U20.3(GPB2)
DIR4: U12.14(DIR) U20.4(GPB3)
DTR: U13.72(DTR) U25.8(A7)
FCLK: U18.6(CLK) U24.33(SPICLK)
FCS: R8.1 U18.1(CS#) U24.32(SPICS0)
FIO0: U18.5(DI) U24.34(SPIQ)
FIO1: U18.2(DO) U24.35(SPID)
GNSSA: JP2.1(SIG) U13.79(GNSS_ANT)
IO3: R10.1 U18.7(IO3) U24.30(SPIHD)
LED1: LED2.2(A) U20.28(GPA7)
LED2: LED3.2(A) U20.27(GPA6)
LED3: LED4.2(A) U20.26(GPA5)
LED4: LED5.2(A) U20.25(GPA4)
LRCLK: U7.14(LRCLK) U24.12(GPIO7)
LTEA: JP1.1(SIG) U13.82(MAIN_ANT)
NETLIGHT: LED1.2(A) U13.51(NETLIGHT)
NS: P1.1 U7.10(OUTN)
PS: P1.2 U7.9(OUTP)
PWRKEY: R5.2 U13.3(PWRKEY) U24.14(GPIO9)
RESET: C40.2 FPC1.9 R12.2 R27.1 R38.1 SW1.1 U13.4(RESET) U20.18(RESET#) U24.4(CHIP_PU) U26.3(RESET#)
RESET_EN: C39.2 R11.2
RI: U13.69(RI) U25.4(A3)
RTS: U13.66(RTS) U25.7(A6)
RXD: U13.68(RXD) U25.5(A4)
SCL: FPC1.7 R26.1 U8.16(SCL) U13.55(I2C_SCL) U16.4(SCL) U20.12(SCL) U24.9(GPIO4) U26.22(SCL)
SCL1: R31.1 U9.10(SCL) U26.5(SC0)
SCL2: R33.1 U10.10(SCL) U26.7(SC1)
SCL3: R35.1 U11.10(SCL) U26.9(SC2)
SCL4: R37.1 U12.10(SCL) U26.11(SC3)
SDA: FPC1.6 R25.1 U8.15(SDA) U13.56(I2C_SDA) U16.3(SDA) U20.13(SDA) U24.10(GPIO5) U26.23(SDA)
SDA1: R30.1 U9.11(SDA) U26.4(SD0)
SDA2: R32.1 U10.11(SDA) U26.6(SD1)
SDA3: R34.1 U11.11(SDA) U26.8(SD2)
SDA4: R36.1 U12.11(SDA) U26.10(SD3)
SDCLK: CARD1.5(CLK(SCLK)) R3.2 U24.24(GPIO18)
SDCMD: CARD1.3(CMD(DI)) R4.2 U24.19(GPIO14)
SDDAT0: CARD1.7(DAT0(D0)) R1.1 U24.23(GPIO17)
SDDAT3: CARD1.2(CDDAT3(CS)) R2.2 U24.25(GPIO19)
SERVO1: P6.2 U24.26(GPIO20)
SIMCD: SIM1.1(CD) U13.53(USIM_DET)
SIMCLK: SIM1.C3(CLK) U13.19(USIM_CLK)
SIMDATA: SIM1.C7(I/O) U13.17(USIM_DATA)
SIMRESET: SIM1.C2(RST) U13.18(USIM_RST)
SIMVCC: SIM1.C1(VCC) U13.20(USIM_VDD)
SPEED1: U9.13(SPEED) U24.18(GPIO13)
SPEED2: U10.13(SPEED) U24.17(GPIO12)
SPEED3: U11.13(SPEED) U24.16(GPIO11)
SPEED4: U12.13(SPEED) U24.15(GPIO10)
TXD: U13.71(TXD) U25.1(A1)
U1: P2.1 U9.17(U) U9.18(U)
U2: P3.1 U10.17(U) U10.18(U)
U3: P4.1 U11.17(U) U11.18(U)
U4: P5.1 U12.17(U) U12.18(U)
UC_RX: U19.3(RXD) U24.50(U0RXD) U25.16(B4)
UC_TX: U19.2(TXD) U24.49(U0TXD) U25.20(B1)
W1: P2.3 U9.21(W) U9.22(W)
W2: P3.3 U10.21(W) U10.22(W)
W3: P4.3 U11.21(W) U11.22(W)
W4: P5.3 U12.21(W) U12.22(W)
$1N4304: B1.1 U8.14(VBAT)
$1N5194: C11.2 U9.1(VCP)
$1N5249: C12.1 U9.2(CPP)
$1N5253: C12.2 U9.3(CPN)
$1N5294: L1.2 U9.4(SW)
$1N5332: C13.1 L1.1
$1N5464: C15.1 U9.7(V1P8)
$1N5569: C17.1 U9.9(V3P3)
$1N6140: C18.2 U10.1(VCP)
$1N6143: C19.1 U10.2(CPP)
$1N6145: C19.2 U10.3(CPN)
$1N6148: L2.2 U10.4(SW)
$1N6150: C20.1 L2.1
$1N6154: C21.1 U10.7(V1P8)
$1N6156: C23.1 U10.9(V3P3)
$1N6626: C24.2 U11.1(VCP)
$1N6629: C25.1 U11.2(CPP)
$1N6631: C25.2 U11.3(CPN)
$1N6634: L3.2 U11.4(SW)
$1N6636: C26.1 L3.1
$1N6640: C27.1 U11.7(V1P8)
$1N6642: C29.1 U11.9(V3P3)
$1N7112: C30.2 U12.1(VCP)
$1N7115: C31.1 U12.2(CPP)
$1N7117: C31.2 U12.3(CPN)
$1N7120: L4.2 U12.4(SW)
$1N7122: C32.1 L4.1
$1N7126: C33.1 U12.7(V1P8)
$1N7128: C35.1 U12.9(V3P3)
$1N11411: R6.2 U13.54(FLIGHTMODE)
$1N15911: C39.1 U19.14(RTS#)
$1N15947: C40.1 U19.13(DTR#)
$1N16177: C41.2 U19.4(V3)
$1N16921: R13.1 U21.6(FREQ)
$1N17019: C42.1 U21.8(BST)
$1N17024: C42.2 D2.1(C) L5.2 U21.1(SW)
$1N27939: R14.1 U21.2(EN)
$1N28112: C45.2 U21.3(COMP)
$1N28119: C45.1 R15.2
$1N28447: R17.1 R23.2 U21.4(FB)
$1N29103: R18.1 U22.6(FREQ)
$1N29104: C47.1 U22.8(BST)
$1N29105: C47.2 D3.1(C) L6.2 U22.1(SW)
$1N29110: C49.2 C51.2 D4.2(A) L6.1 R22.2
$1N29116: R19.1 U22.2(EN)
$1N29118: C50.2 U22.3(COMP)
$1N29121: C50.1 R20.2
$1N29123: R22.1 R41.2 U22.4(FB)
$1N29564: C52.2 D5.2(A) U23.5(VOUT)
$1N29578: C54.1 D4.1(C) D5.1(C)
$1N30113: U24.21(XTAL_32K_P) X1.2
$1N30119: U24.22(XTAL_32K_N) X1.1
$1N30219: C56.1 U24.54(XTAL_P) X2.1(OSC1)
$1N30225: C55.2 U24.53(XTAL_N) X2.3(OSC2)
$1N32513: R29.2 U25.12(B8)
$1N32547: R28.2 U25.9(A8)
$1N39079: R39.2 USBC1.A5(CC1)
$1N39114: R40.2 USBC1.B5(CC2)

Not connected (* = marked no-connect by the designer): CARD1 1(DAT2(RSV))* 8(DAT1(RSV))*; FPC1 12* 13*; SIM1 C6(VPP)*; SW1 3* 4*; SW2 3* 4*; U7 5(N.C.)* 6(N.C.)* 12(N.C.)* 13(N.C.)*; U8 1(32kHz)* 3(INTSQW)* 4(RST)*; U9 6(VREG)* 12(FG)*; U10 6(VREG)* 12(FG)*; U11 6(VREG)* 12(FG)*; U12 6(VREG)* 12(FG)*; U13 6(PCM_CLK/SPI_CLK)* 7(PCM_DOUT/SPI_RX)* 8(PCM_DIN/SPI_TX)* 9(PCM_SYNC/SPI_CS)* 11(VBUS)* 15(VDD_1V8)* 16(GPIO)* 21(NC)* 22(NC)* 23(NC)* 24(NC)* 25(NC)* 26(NC)* 27(NC)* 28(NC)* 29(NC)* 30(NC)* 31(NC)* 32(NC)* 33(GPIO_03)* 34(GPIO_06)* 35(NC)* 36(NC)* 42(DBG_TXD)* 44(VDD_AUX)* 45(GPIO_63)* 46(ADC2)* 47(ADC1)* 48(GPIO_04)* 49(STATUS)* 50(GPIO_43)* 52(GPIO_41)* 59(NC)* 73(MIC_P)* 74(MIC_N)* 75(SPK_P)* 76(SPK_N)* 84(NC)* 85(USB_BOOT●)* 87(GPIO_77)* 88(NC)* 89(NC)* 90(NC)* 91(NC)* 92(NC)* 93(NC)* 94(NC)* 95(NC)* 96(NC)* 97(NC)* 98(Reserved)* 99(NC)* 100(NC)* 101(NC)* 102(NC)* 103(NC)* 104(NC)* 105(NC)* 106(NC)* 107(DBG_RXD)* 108(GPS_PWRCTL)* 109(GPS_RXD)* 112(GPS_VBAT)* 113(GPIO_11)* 114(GPIO_10)* 115(NC)* 116(NC)* 117(1PPS)* 119(USIM2_DATA)* 123(NC)* 124(NC)* 125(NC)* 126(NC)* 127(NC)*; U17 4(NC)*; U19 7(NC.)* 8(OUT#)* 9(CTS#)* 10(DSR#)* 11(RI#)* 12(DCD#)* 15(R232)*; U20 7(GPB6)* 8(GPB7)* 9(VDD)* 10(VSS)* 11(NC)* 14(NC)* 19(INTB)* 20(INTA)* 21(GPA0)* 22(GPA1)*; U23 4(NC)*; U24 1(LNA_IN)* 6(GPIO1)* 7(GPIO2)* 28(SPICS1)* 36(SPICLK_N)* 37(SPICLK_P)*; U26 13(SD4)* 14(SC4)* 15(SD5)* 16(SC5)* 17(SD6)* 18(SC6)* 19(SD7)* 20(SC7)*; USBC1 A2(TX1+)* A3(TX1-)* A8(SBU1)* A10(RX2-)* A11(RX2+)* B2(TX2+)* B3(TX2-)* B8(SBU2)* B10(RX1-)* B11(RX1+)*

## Notes on the sheet
- ESP32
- USB-C
- ESD Prot.
- Free
- Free
- 5V to 3V3
- 11.1V to 3V3
- MICRO SD
- Buttons
- 11.1V to 4V
- Speaker + Mic
- LEDs
- Speaker Connector
- RTC IC
- Speaker Amp
- SPI Flash chip
- USB-to-Serial + BOOT
- CAMERA
- GPIO EXP.
- Servo
- Battery
- 4V to 1.8V
- Fuel Gauge IC
- Battery Connector
- GPS + SIM
- SCL/SDA wtv
- Level Shifter
- BLDC driver + Motor connectors
